# Altium schematic sheet 09_Misc.SchDoc: Misc (part 1 of 3)
size A3; Organization: Lime Microsystems; Address1: Surrey Tech Centre; Address2: Guildford GU2 7YG; Address3: Surrey; Address4: United Kingdom; Revision: v1.0; SheetNumber: 10; SheetTotal: 10
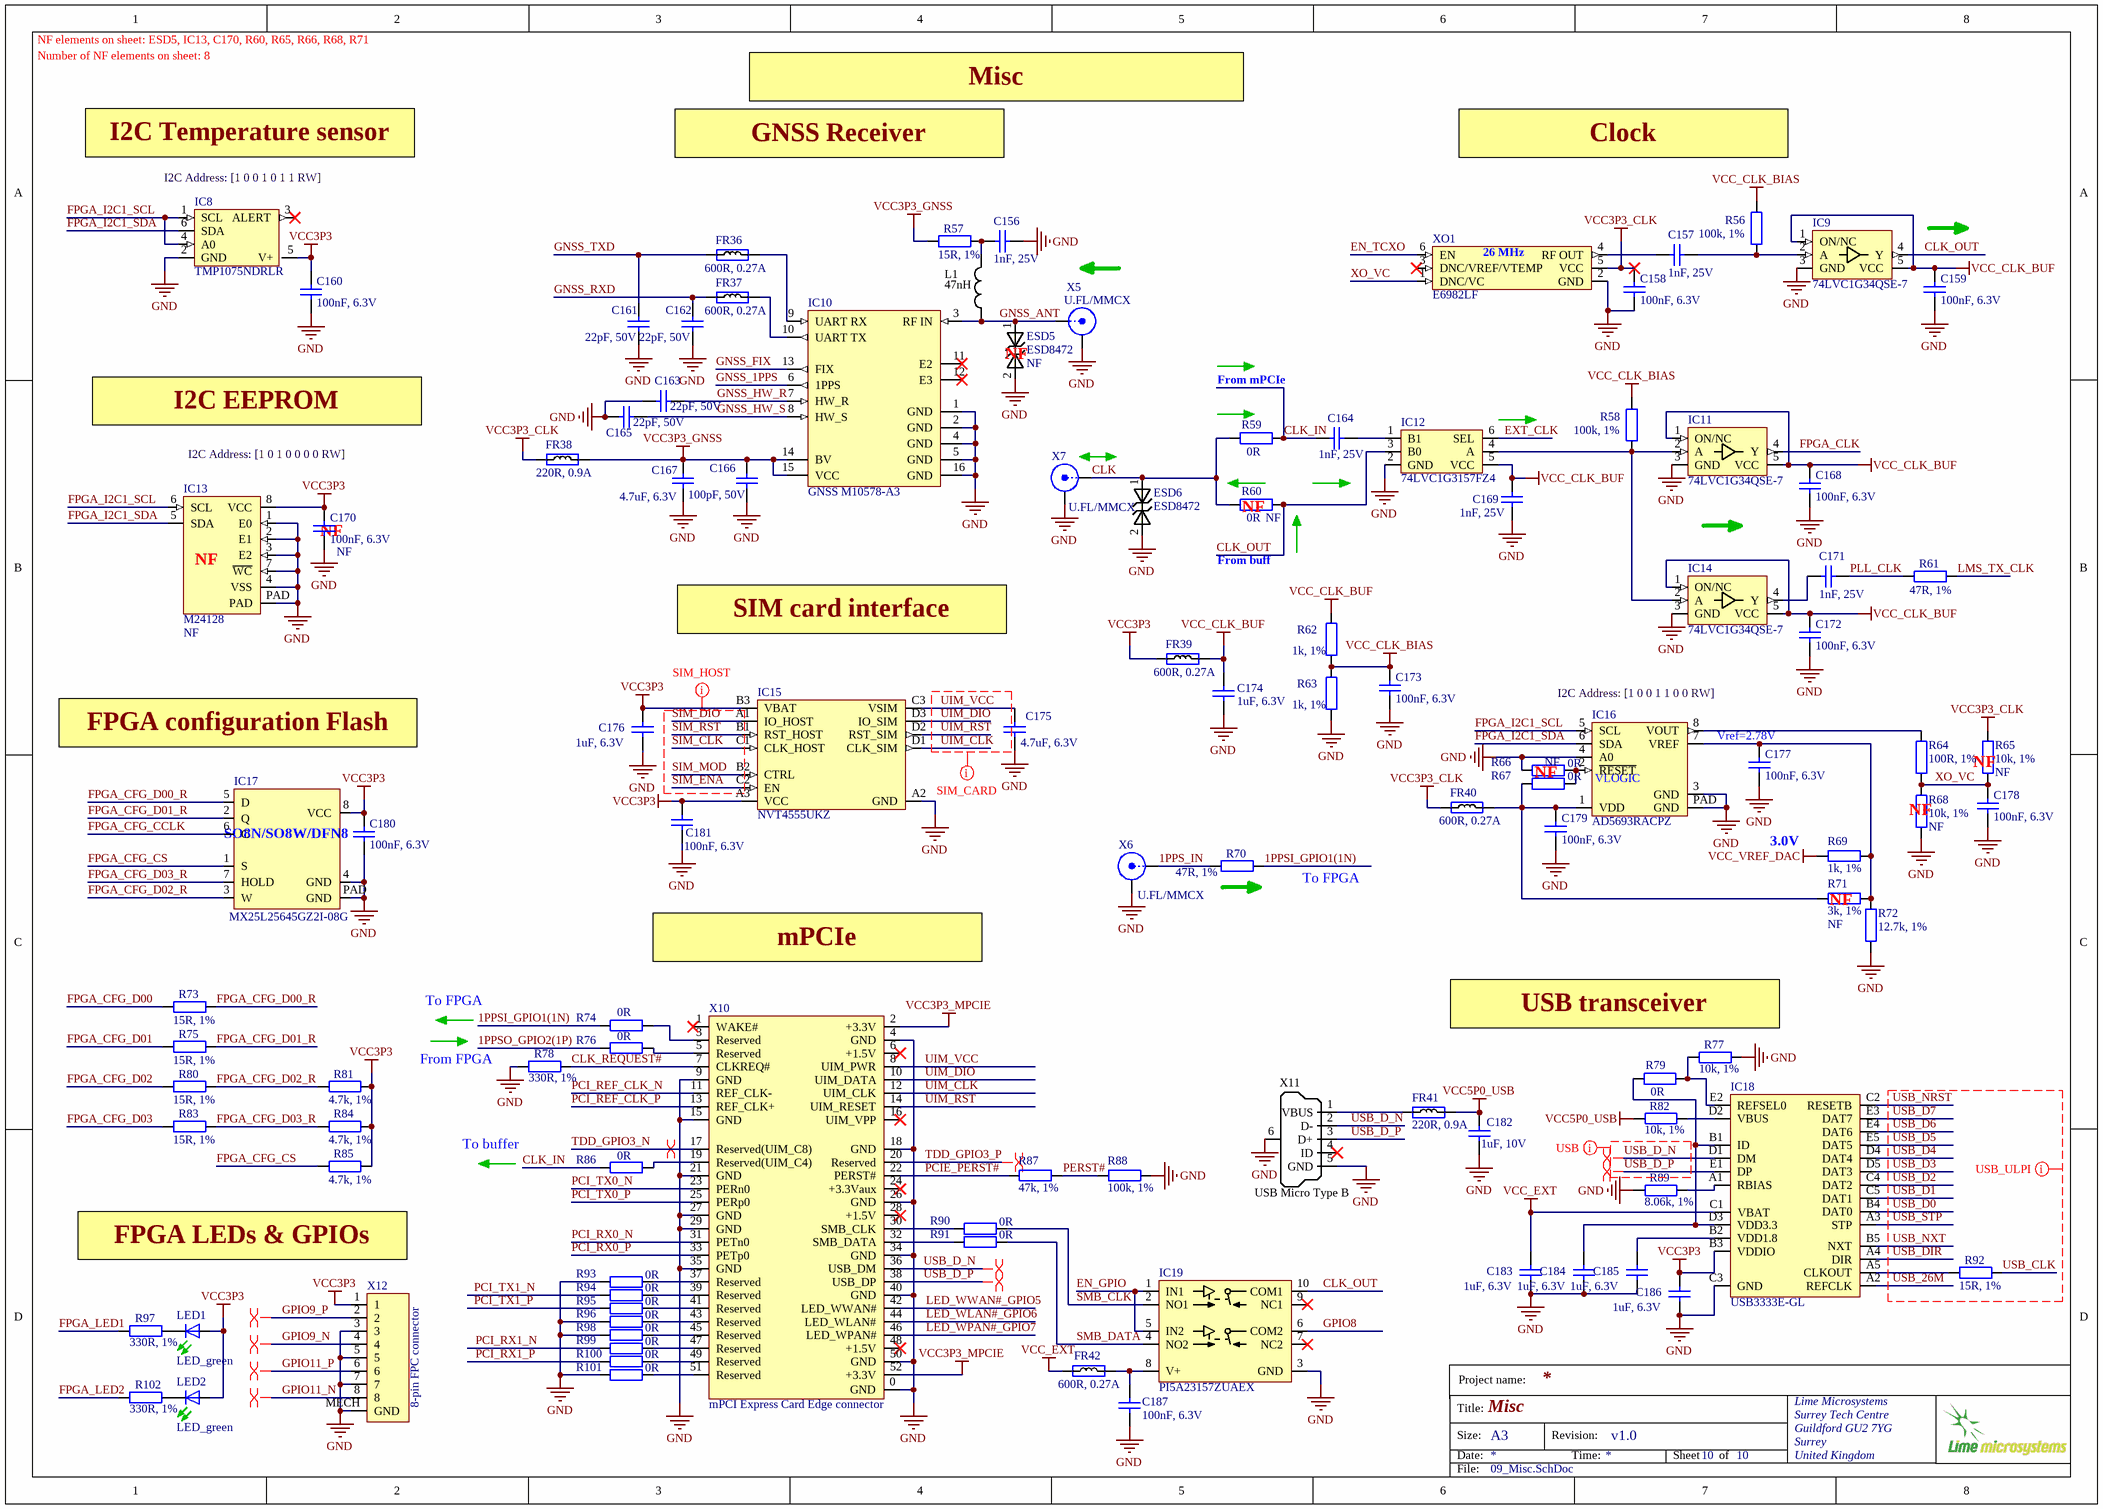
[diagram p0: 09_Misc.SchDoc]

## Parts
C156  1nF, 25V  [CAP0201]
C157  1nF, 25V  [CAP0201]
C158  100nF, 6.3V  [CAP0201]
C159  100nF, 6.3V  [CAP0201]
C160  100nF, 6.3V  [CAP0201]
C161  22pF, 50V  [CAP0201]
C162  22pF, 50V  [CAP0201]
C163  22pF, 50V  [CAP0201]
C164  1nF, 25V  [CAP0201]
C165  22pF, 50V  [CAP0201]
C166  100pF, 50V  [CAP0201]
C167  4.7uF, 6.3V  [CAP0402]
C168  100nF, 6.3V  [CAP0201]
C169  1nF, 25V  [CAP0201]
C170  100nF, 6.3V  Assembly Info: NF  [CAP0201]
C171  1nF, 25V  [CAP0201]
C172  100nF, 6.3V  [CAP0201]
C173  100nF, 6.3V  [CAP0201]
C174  1uF, 6.3V  [CAP0201]
C175  4.7uF, 6.3V  [CAP0402]
C176  1uF, 6.3V  [CAP0201]
C177  100nF, 6.3V  [CAP0201]
C178  100nF, 6.3V  [CAP0201]
C179  100nF, 6.3V  [CAP0201]
C180  100nF, 6.3V  [CAP0201]
C181  100nF, 6.3V  [CAP0201]
C182  1uF, 10V  [CAP0402]
C183  1uF, 6.3V  [CAP0201]
C184  1uF, 6.3V  [CAP0201]
C185  1uF, 6.3V  [CAP0201]
C186  1uF, 6.3V  [CAP0201]
C187  100nF, 6.3V  [CAP0201]
ESD5  ESD8472  Assembly Info: NF  [ESD8472_X3DFN2]
ESD6  ESD8472  [ESD8472_X3DFN2]
FR36  600R, 0.27A  [RES0201]
FR37  600R, 0.27A  [RES0201]
FR38  220R, 0.9A  [RES0402]
FR39  600R, 0.27A  [RES0201]
FR40  600R, 0.27A  [RES0201]
FR41  220R, 0.9A  [RES0402]
FR42  600R, 0.27A  [RES0201]
IC8  TMP1075NDRLR  [TMP1075NDRLR_temperature_sensor_SOT563]
IC9  74LVC1G34QSE-7  [74AHCT1G126SE-7_BUFFER_SOT353]
IC10  GNSS M10578-A3  [M10578-A3_v2]
IC11  74LVC1G34QSE-7  [74AHCT1G126SE-7_BUFFER_SOT353]
IC12  74LVC1G3157FZ4  [74LVC1G3157FZ4_SPDT_SW_DFN1410-6]
IC13  M24128  Assembly Info: NF  [M24128-DFMC6TG]
IC14  74LVC1G34QSE-7  [74AHCT1G126SE-7_BUFFER_SOT353]
IC15  NVT4555UKZ  [NVT4555UKZ_SIM_INTERFACE_WLCSP12]
IC16  AD5693RACPZ  [AD5693RACPZ-1RL7_DAC_8LFCSP]
IC17  MX25L25645GZ2I-08G  [S25FL164K_WSON8_DFN6]
IC18  USB3333E-GL  [USB3333E-GL_USB_PHY_25WLCSP]
IC19  PI5A23157ZUAEX  [PI5A23157ZUAEX_SPDT_SW_10UQFN]
L1  47nH  [RES0402]
LED1  LED_green  [LED0201]
LED2  LED_green  [LED0201]
R56  100k, 1%  [RES0201]
R57  15R, 1%  [RES0201]
R58  100k, 1%  [RES0201]
R59  0R  [RES0201]
R60  0R  Assembly Info: NF  [RES0201]
R61  47R, 1%  [RES0201]
R62  1k, 1%  [RES0201]
R63  1k, 1%  [RES0201]
R64  100R, 1%  [RES0201]
R65  10k, 1%  Assembly Info: NF  [RES0201]
R66  0R  Assembly Info: NF  [RES0201]
R67  0R  [RES0201]
R68  10k, 1%  Assembly Info: NF  [RES0201]
R69  1k, 1%  [RES0201]
R70  47R, 1%  [RES0201]
R71  3k, 1%  Assembly Info: NF  [RES0201]
R72  12.7k, 1%  [RES0201]
R73  15R, 1%  [RES0201]
R74  0R  [RES0201]
R75  15R, 1%  [RES0201]
R76  0R  [RES0201]
R77  10k, 1%  [RES0201]
R78  330R, 1%  [RES0201]
R79  0R  [RES0201]
R80  15R, 1%  [RES0201]
R81  4.7k, 1%  [RES0201]
R82  10k, 1%  [RES0201]
R83  15R, 1%  [RES0201]
R84  4.7k, 1%  [RES0201]
R85  4.7k, 1%  [RES0201]
R86  0R  [RES0201]
R87  47k, 1%  [RES0201]
R88  100k, 1%  [RES0201]
R89  8.06k, 1%  [RES0201]
R90  0R  [RES0201]
R91  0R  [RES0201]
R92  15R, 1%  [RES0201]
R93  0R  [RES0201]
R94  0R  [RES0201]
R95  0R  [RES0201]
R96  0R  [RES0201]
R97  330R, 1%  [RES0201]
R98  0R  [RES0201]
R99  0R  [RES0201]
R100  0R  [RES0201]
R101  0R  [RES0201]
R102  330R, 1%  [RES0201]
X5  U.FL/MMCX  [MMCX_UFL_conn_u_v2]
X6  U.FL/MMCX  [MMCX_UFL_conn_u_v2]
X7  U.FL/MMCX  [MMCX_UFL_conn_u_v2]
X10  mPCI Express Card Edge connector  [PCIe_MiniCard]  (no BOM)
X11  USB Micro Type B  [USB_Micro_TypeB_47346-0001]
X12  8-pin FPC connector  [503480-0800_8PIN_FPC_CONN]
XO1  E6982LF  [RAKON_E8231LF_E6982LF]

## Nets
GND: C156.2 C158.2 C159.2 C160.2 C161.2 C162.2 C163.2 C165.2 C166.1 C167.1 C168.2 C169.1 C170.2 C172.2 C173.2 C174.2 C175.1 C176.2 C177.2 C178.2 C179.2 C180.2 C181.2 C182.1 C183.2 C184.2 C185.2 C186.2 C187.2 ESD5.2 ESD6.2 IC8.2(GND) IC9.3(GND) IC10.1(GND) IC10.2(GND) IC10.4(GND) IC10.5(GND) IC10.16(GND) IC11.3(GND) IC12.2(GND) IC13.1(E0) IC13.2(E1) IC13.3(E2) IC13.4(VSS) IC13.7(~{WC}) IC13.PAD IC14.3(GND) IC15.A2(GND) IC16.3(GND) IC16.4(A0) IC16.PAD(GND) IC17.4(GND) IC17.PAD(GND) IC18.C3(GND) IC19.3(GND) R63.2 R66.1 R68.2 R72.2 R77.1 R78.2 R88.1 R89.2 R93.1 R96.1 R98.1 R101.1 X5.2(Y) X6.2(Y) X7.2(Y) X10.0(GND) X10.4(GND) X10.9(GND) X10.15(GND) X10.18(GND) X10.21(GND) X10.26(GND) X10.27(GND) X10.29(GND) X10.34(GND) X10.35(GND) X10.40(GND) X10.50(GND) X11.5(GND) X11.6(Shell) X12.3 X12.5 X12.7 X12.MECH(GND) XO1.2(GND)
VCC3P3: C160.1 C170.1 C176.1 C180.1 C181.1 C186.1 FR39.1 IC8.5(V+) IC13.8(VCC) IC15.A3(VCC) IC15.B3(VBAT) IC17.8(VCC) IC18.B3(VDDIO) LED1.A LED2.A R81.1 R84.1 R85.1 X12.1
VCC3P3_CLK: C158.1 FR38.1 FR40.1 R65.1 XO1.5(VCC)
VCC3P3_GNSS: C166.2 C167.2 FR38.2 IC10.14(BV) IC10.15(VCC) R57.2
VCC3P3_MPCIE: X10.2(+3.3V) X10.52(+3.3V)
VCC5P0_USB: C182.2 FR41.2 R82.2
VCC_CLK_BIAS: C173.1 R56.2 R58.2 R62.2 R63.1
VCC_CLK_BUF: C159.1 C168.1 C169.2 C172.1 C174.1 FR39.2 IC9.1(ON/NC) IC9.5(VCC) IC11.1(ON/NC) IC11.5(VCC) IC12.5(VCC) IC14.1(ON/NC) IC14.5(VCC) R62.1
VCC_EXT: C183.1 FR42.1 IC18.C1(VBAT)
VCC_VREF_DAC: R69.2
1PPS_IN: R70.2 X6.1(X)
1PPSI_GPIO1(1N): R70.1 R74.1
1PPSO_GPIO2(1P): R76.1
CLK: ESD6.1 R59.1 R60.1 X7.1(X)
CLK_IN: C164.1 R59.2 R86.1
CLK_OUT: IC9.4(Y) IC12.3(B0) IC19.10(COM1) R60.2
CLK_REQUEST#: R78.1 X10.7(CLKREQ#)
EN_GPIO: IC19.1(IN1) IC19.5(IN2)
EN_TCXO: XO1.6(EN)
EXT_CLK: IC12.6(SEL)
FPGA_CFG_CCLK: IC17.6(C)
FPGA_CFG_CS: IC17.1(S) R85.2
FPGA_CFG_D00: R73.2
FPGA_CFG_D00_R: IC17.5(D) R73.1
FPGA_CFG_D01: R75.2
FPGA_CFG_D01_R: IC17.2(Q) R75.1
FPGA_CFG_D02: R80.2
FPGA_CFG_D02_R: IC17.3(W) R80.1 R81.2
FPGA_CFG_D03: R83.2
FPGA_CFG_D03_R: IC17.7(HOLD) R83.1 R84.2
FPGA_CLK: IC11.4(Y)
FPGA_I2C1_SCL: IC8.1(SCL) IC8.4(A0) IC13.6(SCL) IC16.5(SCL)
FPGA_I2C1_SDA: IC8.6(SDA) IC13.5(SDA) IC16.6(SDA)
FPGA_LED1: R97.2
FPGA_LED2: R102.2
GNSS_1PPS: IC10.6(1PPS)
GNSS_ANT: ESD5.1 IC10.3(RF_IN) L1.1 X5.1(X)
GNSS_FIX: IC10.13(FIX)
GNSS_HW_R: C163.1 IC10.7(HW_R)
GNSS_HW_S: C165.1 IC10.8(HW_S)
GNSS_RXD: C162.1 FR37.1
GNSS_TXD: C161.1 FR36.1
GPIO8: IC19.6(COM2)
GPIO9_N: X12.4
GPIO9_P: X12.2
GPIO11_N: X12.8
GPIO11_P: X12.6
LED_WLAN#_GPIO6: X10.44(LED_WLAN#)
LED_WPAN#_GPIO7: X10.46(LED_WPAN#)
LED_WWAN#_GPIO5: X10.42(LED_WWAN#)
LMS_TX_CLK: R61.1
PCI_REF_CLK_N: X10.11(REF_CLK-)
PCI_REF_CLK_P: X10.13(REF_CLK+)
PCI_RX0_N: X10.31(PETn0)
PCI_RX0_P: X10.33(PETp0)
PCI_RX1_N: R99.1
PCI_RX1_P: R100.1
PCI_TX0_N: X10.23(PERn0)
PCI_TX0_P: X10.25(PERp0)
PCI_TX1_N: R94.1
PCI_TX1_P: R95.1
PCIE_PERST#: R87.1 X10.22(PERST#)
PERST#: R87.2 R88.2
PLL_CLK: C171.2 R61.2
SIM_CLK: IC15.C1(CLK_HOST)
SIM_DIO: IC15.A1(IO_HOST)
SIM_ENA: IC15.C2(EN)
SIM_MOD: IC15.B2(CTRL)
SIM_RST: IC15.B1(RST_HOST)
SMB_CLK: IC19.2(NO1) R90.2
SMB_DATA: IC19.4(NO2) R91.2
TDD_GPIO3_N: X10.17(Reserved(UIM_C8))
TDD_GPIO3_P: X10.20(Reserved)
UIM_CLK: IC15.D1(CLK_SIM) X10.12(UIM_CLK)
UIM_DIO: IC15.D3(IO_SIM) X10.10(UIM_DATA)
UIM_RST: IC15.D2(RST_SIM) X10.14(UIM_RESET)
UIM_VCC: C175.2 IC15.C3(VSIM) X10.8(UIM_PWR)
USB_26M: IC18.A2(REFCLK)
USB_CLK: R92.1
USB_D0: IC18.B4(DAT0)
USB_D1: IC18.C5(DAT1)
USB_D2: IC18.C4(DAT2)
USB_D3: IC18.D5(DAT3)
USB_D4: IC18.D4(DAT4)
USB_D5: IC18.E5(DAT5)
USB_D6: IC18.E4(DAT6)
USB_D7: IC18.E3(DAT7)
USB_D_N: IC18.D1(DM) X10.36(USB_DM) X11.2(D-)
USB_D_P: IC18.E1(DP) X10.38(USB_DP) X11.3(D+)
USB_DIR: IC18.A4(DIR)
USB_NRST: IC18.C2(RESETB)
USB_NXT: IC18.B5(NXT)
USB_STP: IC18.A3(STP)
XO_VC: C178.1 R64.2 R65.2 R68.1 XO1.1(DNC/VC)
NetC156_1: C156.1 L1.2 R57.1
NetC157_1: C157.1 XO1.4(RF_OUT)
NetC157_2: C157.2 IC9.2(A) R56.1
NetC164_2: C164.2 IC12.1(B1)
NetC171_1: C171.1 IC14.4(Y)
NetC177_1: C177.1 IC16.7(VREF) R69.1 R71.1 R72.1
NetC179_1: C179.1 FR40.2 IC16.1(VDD) R67.1 R71.2
NetC184_1: C184.1 IC18.B1(ID) IC18.D3(VDD3.3) R79.1
NetC185_1: C185.1 IC18.B2(VDD1.8)
NetC187_1: C187.1 FR42.2 IC19.8(V+)
NetFR36_2: FR36.2 IC10.9(UART_RX)
NetFR37_2: FR37.2 IC10.10(UART_TX)
NetFR41_1: FR41.1 X11.1(VBUS)
NetIC11_2: IC11.2(A) IC12.4(A) IC14.2(A) R58.1
NetIC16_2: IC16.2(~{RESET}) R66.2 R67.2
NetIC16_8: IC16.8(VOUT) R64.1
NetIC18_A1: IC18.A1(RBIAS) R89.1
NetIC18_A5: IC18.A5(CLKOUT) R92.2
NetIC18_D2: IC18.D2(VBUS) R82.1
NetIC18_E2: IC18.E2(REFSEL0) R77.2 R79.2
NetLED1_K: LED1.K(C) R97.1
NetLED2_K: LED2.K(C) R102.1
NetR74_2: R74.2 X10.3(Reserved)
NetR76_2: R76.2 X10.5(Reserved)
NetR86_2: R86.2 X10.19(Reserved(UIM_C4))
NetR90_1: R90.1 X10.30(SMB_CLK)
NetR91_1: R91.1 X10.32(SMB_DATA)
NetR93_2: R93.2 X10.37(Reserved)
NetR94_2: R94.2 X10.39(Reserved)
NetR95_2: R95.2 X10.41(Reserved)
NetR96_2: R96.2 X10.43(Reserved)
NetR98_2: R98.2 X10.45(Reserved)
NetR99_2: R99.2 X10.47(Reserved)
NetR100_2: R100.2 X10.49(Reserved)
NetR101_2: R101.2 X10.51(Reserved)

Not connected (* = marked no-connect by the designer): IC8 3(ALERT)*; IC10 11(E2)* 12(E3)*; IC19 7(NC2)* 9(NC1)*; X10 1(WAKE#)* 6(+1.5V)* 16(UIM_VPP)* 24(+3.3Vaux)* 28(+1.5V)* 48(+1.5V)*; X11 4(ID)*; XO1 3(DNC/VREF/VTEMP)*

## Layout directives
net class SIM_HOST: SIM_CLK, SIM_DIO, SIM_ENA, SIM_MOD, SIM_RST
net class SIM_CARD: UIM_CLK, UIM_DIO, UIM_RST, UIM_VCC
differential pair: GPIO9_N, GPIO9_P, GPIO11_N, GPIO11_P, TDD_GPIO3_N, TDD_GPIO3_P, USB_D_N, USB_D_P
net class USB: USB_D_N, USB_D_P
net class USB_ULPI: USB_26M, USB_CLK, USB_D0, USB_D1, USB_D2, USB_D3, USB_D4, USB_D5, USB_D6, USB_D7, USB_DIR, USB_NRST, USB_NXT, USB_STP

## Notes on the sheet
- NF elements on sheet: ESD5, IC13, C170, R60, R65, R66, R68, R71
- Number of NF elements on sheet: 8
- Misc
- I2C Temperature sensor
- (near IC8) I2C Address: [1 0 0 1 0 1 1 RW]
- GNSS Receiver
- Clock
- (near XO1) 26 MHz
- (near ESD5) NF
- From mPCIe
- I2C EEPROM
- I2C Address: [1 0 1 0 0 0 0 RW]
- (near R60) NF
- (near IC13) NF
- (near C170) NF
- (near R60) From buff
- SIM card interface
- (near IC16) I2C Address: [1 0 0 1 1 0 0 RW]
- FPGA configuration Flash
- NF
- (near IC16) VLOGIC
- (near C177) Vref=2.78V
- (near R65) NF
- (near R69) 3.0V
- (near R68) NF
- (near R70) To FPGA
- (near R71) NF
- mPCIe
- To FPGA
- (near R77) USB transceiver
- From FPGA
- To buffer
- FPGA LEDs & GPIOs
- Project name:
- Title:
- Size:
- Date:
- A3
- Revision:
- Time:
- Sheet
- of
- File:
- (in symbol M25P40_with_pad) SO8N/SO8W/DFN8